# EAGLE schematic gyro_volt-divide (EAGLE 8.6.0)
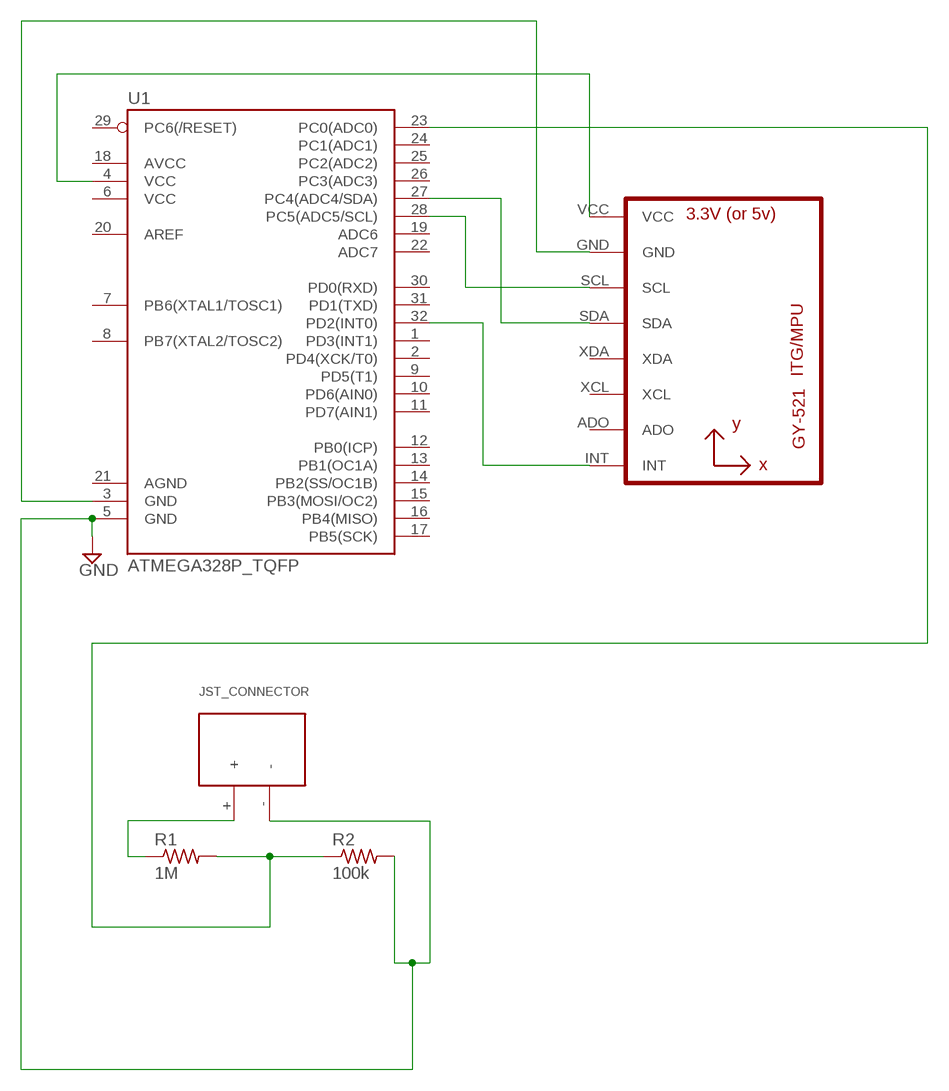
[diagram p0: schematic, sheet 1]

## Parts
R1  1M  R-US_R0603  [R0603]
R2  100k  R-US_R0603  [R0603]
U1  ATMEGA328P_TQFP  [TQFP32-08]
U2  GY-521MPU6050  [GY-521]
U$1  JST_CONNECTOR_FEMALE  [JST_CONNECTOR_FEMALE]

## Nets
GND: R2.2 U1.5(GND) U$1.-
N$1: U1.4(VCC) U2.VCC
N$2: U1.3(GND) U2.GND
N$3: U1.28(PC5(ADC5/SCL)) U2.SCL
N$4: U1.27(PC4(ADC4/SDA)) U2.SDA
N$5: U1.32(PD2(INT0)) U2.INT
N$6: R1.1 U$1.+
N$7: R1.2 R2.1 U1.23(PC0(ADC0))
Unconnected: U1.1(PD3(INT1)) U1.2(PD4(XCK/T0)) U1.6(VCC) U1.7(PB6(XTAL1/TOSC1)) U1.8(PB7(XTAL2/TOSC2)) U1.9(PD5(T1)) U1.10(PD6(AIN0)) U1.11(PD7(AIN1)) U1.12(PB0(ICP)) U1.13(PB1(OC1A)) U1.14(PB2(SS/OC1B)) U1.15(PB3(MOSI/OC2)) U1.16(PB4(MISO)) U1.17(PB5(SCK)) U1.18(AVCC) U1.19(ADC6) U1.20(AREF) U1.21(AGND) U1.22(ADC7) U1.24(PC1(ADC1)) U1.25(PC2(ADC2)) U1.26(PC3(ADC3)) U1.29(PC6(/RESET)) U1.30(PD0(RXD)) U1.31(PD1(TXD)) U2.ADO U2.XCL U2.XDA

## Library data of the parts
R1 R2 = rcl:R-US_: RESISTOR, American symbol; SPICEPREFIX: R
U1 = quad:ATMEGA328P_TQFP; PROD_ID: IC-09069
U2 = quad:GY-521
U$1 = quad:JST_CONNECTOR_FEMALE